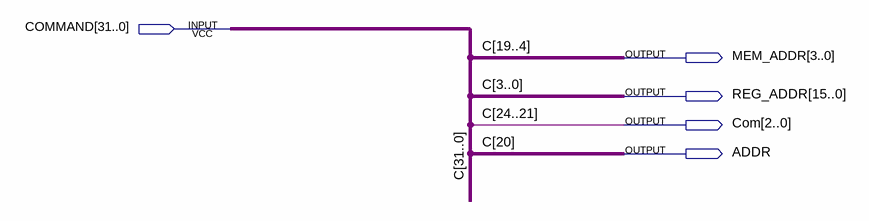
[diagram p0: schematic sheet]
// Quartus schematic CommandSeparator.bdf as structural Verilog: 0 symbols, 5 pins
module CommandSeparator (
  input  [31:0] COMMAND,
  output [3:0] MEM_ADDR,
  output [15:0] REG_ADDR,
  output [2:0] Com,
  output ADDR
);


  assign ADDR = COMMAND[20];

  // Other names for the same wires on the sheet: C[31:0] = COMMAND
endmodule
